# EAGLE schematic main-unit-psu (EAGLE 9.6.2)
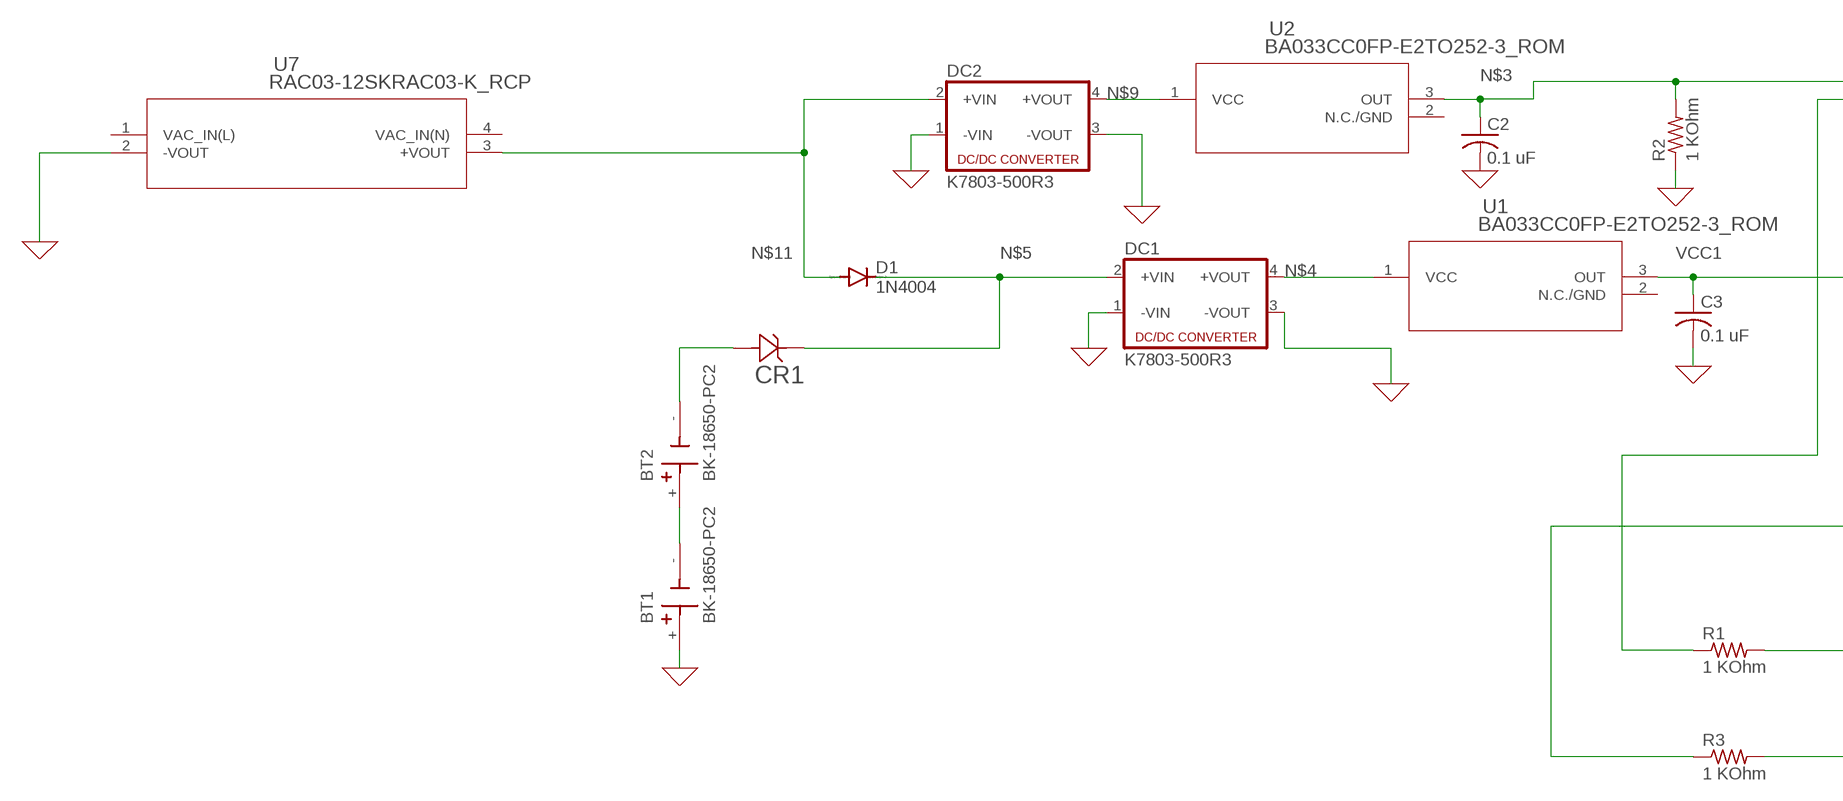
[diagram p0: schematic, sheet 1, part 1 of 2]
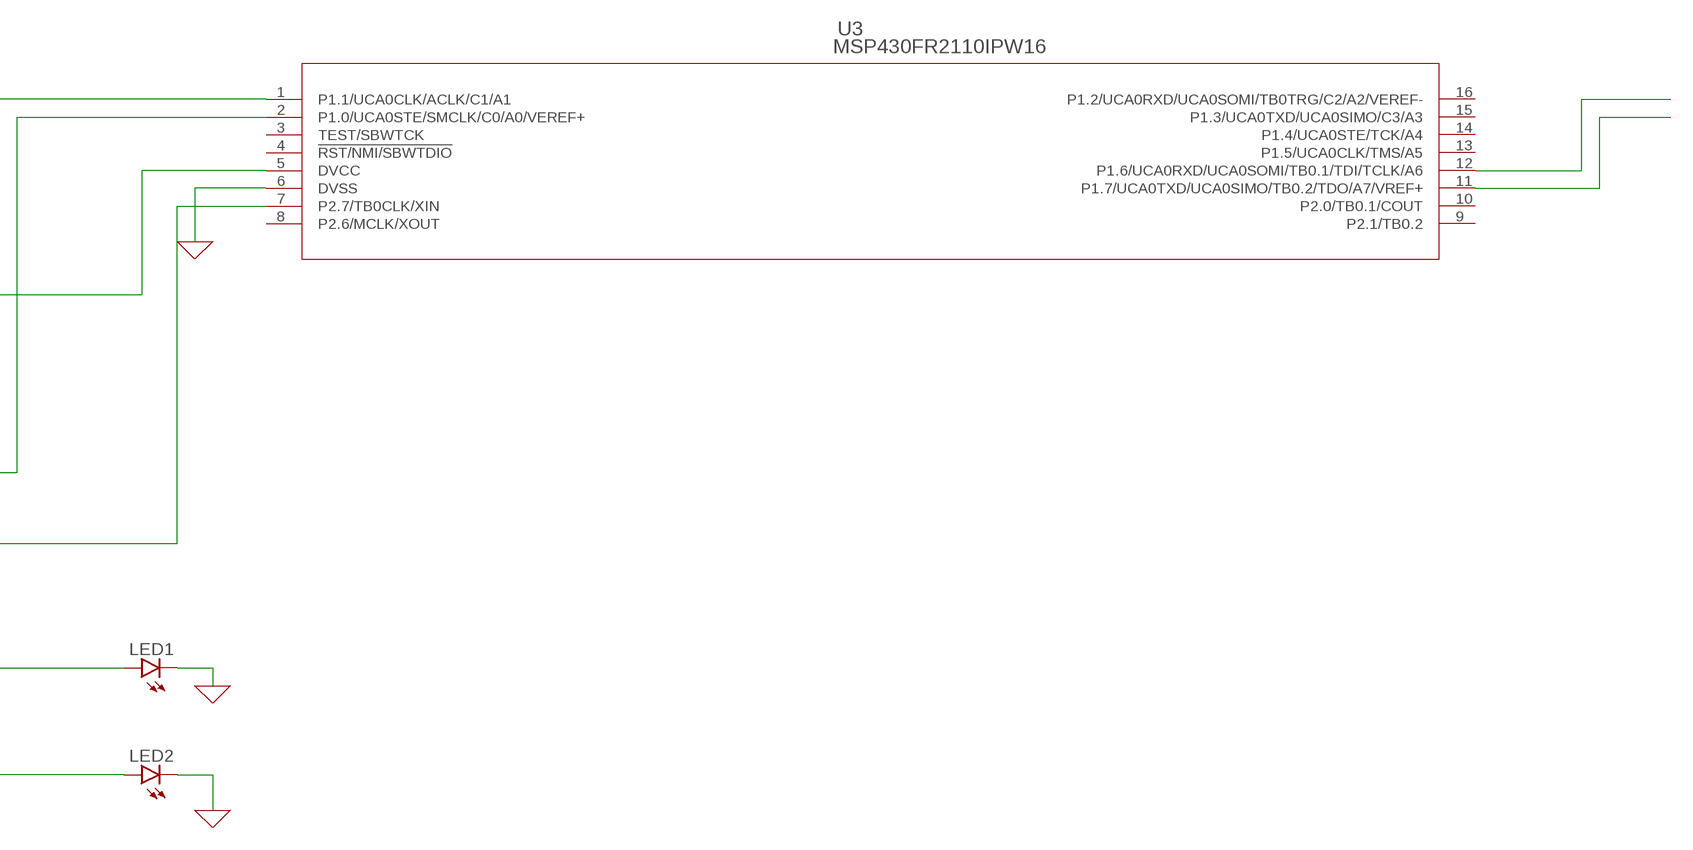
[diagram p1: schematic, sheet 1, part 2 of 2]

## Parts
BT1  BK-18650-PC2  [BAT_BK-18650-PC2]
BT2  BK-18650-PC2  [BAT_BK-18650-PC2]
C2  0.1 uF  C-US050-024X044  [C050-024X044]
C3  0.1 uF  C-US050-024X044  [C050-024X044]
CR1  1N5819DO-41_STM  [DO-41_STM]
D1  1N4004  [DO41-10]
DC1  K7803-500R3  NME  [NME]
DC2  K7803-500R3  NME  [NME]
LED1  LED5MM  [LED5MM]
LED2  LED5MM  [LED5MM]
R1  1 KOhm  R-US_0204/7  [0204/7]
R2  1 KOhm  R-US_0207/2V  [0207/2V]
R3  1 KOhm  R-US_0204/7  [0204/7]
U1  BA033CC0FP-E2TO252-3_ROM  [TO252-3_ROM]
U2  BA033CC0FP-E2TO252-3_ROM  [TO252-3_ROM]
U3  MSP430FR2110IPW16  [PW16_TEX]
U7  RAC03-12SKRAC03-K_RCP  [RAC03-K_RCP]

## Nets
0: BT1.+ C2.2 C3.2 DC1.1(-VIN) DC1.3(-VOUT) DC2.1(-VIN) DC2.3(-VOUT) LED1.K(C) LED2.K(C) R2.1 U3.6(DVSS) U7.2(-VOUT) ; supply symbol labelled GND
N$3: C2.1 R2.2 U2.3(OUT) U3.1(P1.1/UCA0CLK/ACLK/C1/A1)
N$4: DC1.4(+VOUT) U1.1(VCC)
N$5: CR1.1 D1.C DC1.2(+VIN)
N$6: BT1.- BT2.+
N$7: BT2.- CR1.2
N$9: DC2.4(+VOUT) U2.1(VCC)
N$10: U3.12(P1.6/UCA0RXD/UCA0SOMI/TB0.1/TDI/TCLK/A6)
N$11: D1.A DC2.2(+VIN) U7.3(+VOUT)
N$13: U3.11(P1.7/UCA0TXD/UCA0SIMO/TB0.2/TDO/A7/VREF+)
N$15: R3.1 U3.7(P2.7/TB0CLK/XIN)
N$16: LED1.A R1.2
N$17: LED2.A R3.2
N$22: R1.1 U3.2(P1.0/UCA0STE/SMCLK/C0/A0/VEREF+)
VCC1: C3.1 U1.3(OUT) U3.5(DVCC)
Unconnected: U1.2(N.C./GND) U2.2(N.C./GND) U3.3(TEST/SBWTCK) U3.4(!RST/NMI/SBWTDIO) U3.8(P2.6/MCLK/XOUT) U3.9(P2.1/TB0.2) U3.10(P2.0/TB0.1/COUT) U3.13(P1.5/UCA0CLK/TMS/A5) U3.14(P1.4/UCA0STE/TCK/A4) U3.15(P1.3/UCA0TXD/UCA0SIMO/C3/A3) U3.16(P1.2/UCA0RXD/UCA0SOMI/TB0TRG/C2/A2/VEREF-)

## Power pins joined to a net without a drawn wire
VAC_IN(L): U7.1(VAC_IN(L))
VAC_IN(N): U7.4(VAC_IN(N))

## Library data of the parts
BT1 BT2 = BK-18650-PC2:BK-18650-PC2: Battery Holder (Open) 18650 1 Cell PC Pin Check availability <https://pricing.snapeda.com/parts/BK-18650-PC2/MPD%20%28Memory%20Protection%20Devices%29/view-part?ref=eda>; AVAILABILITY: In Stock; DESCRIPTION: Battery Holder (Open) 18650 1 Cell PC Pin; MF: MPD (Memory Protection Devices); MP: BK-18650-PC2; PACKAGE: None; PRICE: None; PURCHASE-URL: https://pricing.snapeda.com/search/part/BK-18650-PC2/?ref=eda
C2 C3 = rcl:C-US: CAPACITOR, American symbol; SPICEPREFIX: C
CR1 = 2023-04-06_19-32-50_Library:1N5819; COPYRIGHT: Copyright (C) 2023 Ultra Librarian. All rights reserved.; DIGI-KEY_PART_NUMBER_1: 1N5819FSCT-ND; DIGI-KEY_PART_NUMBER_2: 1N5819FSTR-ND; DIGI-KEY_PART_NUMBER_3: 2156-1N5819-ND; DIGI-KEY_PART_NUMBER_4: 2368-1N5819-ND; DIGI-KEY_PART_NUMBER_5: 2796-1N5819TR-ND; DIGI-KEY_PART_NUMBER_6: 497-6610-1-ND; DIGI-KEY_PART_NUMBER_7: 497-6610-3-ND; MANUFACTURER_PART_NUMBER: 1N5819; MFR_NAME: STMicroelectronics
D1 = diode:1N4004: DIODE general purpose rectifier, 1 A
DC1 DC2 = dc-dc-converter:NME: DC-DC CONVERTER; MF: C & D TECHNOLOGIES, INC; MPN: NME1205D; OC_FARNELL: 1021466; OC_NEWARK: 98B8198
LED1 LED2 = led:LED: LED OSRAM: - CHIPLED LG R971, LG N971, LY N971, LG Q971, LY Q971, LO R971, LY R971 LH N974, LH R974 LS Q976, LO Q976, LY Q976 LO Q996 - Hyper CHIPLED LW Q18S LB Q993, LB Q99A, LB R99A - SideLED LS A670, LO A670, LY A670, LG A670, LP A670 LB A673, LV A673, LT A673, LW A673 LH A674 LY A675 LS A676, LA A676, LO A676, LY A676, LW A676 LS A679, LY A679, LG A679 - Hyper Micro SIDELED® LS Y876, LA Y876, LO Y876, LY Y876 LT Y87S - SmartLED LW L88C, LW L88S LB L89C, LB L89S, LG L890 LS L89K, LO L89K, LY L89K LS L896, LA L896, LO L896, LY L896 - TOPLED LS T670, LO T670, LY T670, LG T670, LP T670 LSG T670, LSP T670, LSY T670, LOP T670, LYG T670 LG T671, LOG T671, LSG T671 LB T673, LV T673, LT T673, LW T673 LH T674 LS T676, LA T676, LO T676, LY T676, LB T676, LH T676, LSB T676, LW T676 LB T67C, LV T67C, LT T67C, LS T67K, LO T67K, LY T67K, LW E67C LS E67B, LA E67B, LO E67B, LY E67B, LB E67C, LV E67C, LT E67C LW T67C LS T679, LY T679, LG T679 LS T770, LO T770, LY T770, LG T770, LP T770 LB T773, LV T773, LT T773, LW T773 LH T774 LS E675, LA E675, LY E675, LS T675 LS T776, LA T776, LO T776, LY T776, LB T776 LHGB T686 LT T68C, LB T68C - Hyper Mini TOPLED® LB M676 - Mini TOPLED Santana® LG M470 LS M47K, LO M47K, LY M47K Source: http://www.osram.convergy.de LUXEON: - LUMILED® LXK2-PW12-R00, LXK2-PW12-S00, LXK2-PW14-U00, LXK2-PW14-V00 LXK2-PM12-R00, LXK2-PM12-S00, LXK2-PM14-U00 LXK2-PE12-Q00, LXK2-PE12-R00, LXK2-PE12-S00, LXK2-PE14-T00, LXK2-PE14-U00 LXK2-PB12-K00, LXK2-PB12-L00, LXK2-PB12-M00, LXK2-PB14-N00, LXK2-PB14-P00, LXK2-PB14-Q00 LXK2-PR12-L00, LXK2-PR12-M00, LXK2-PR14-Q00, LXK2-PR14-R00 LXK2-PD12-Q00, LXK2-PD12-R00, LXK2-PD12-S00 LXK2-PH12-R00, LXK2-PH12-S00 LXK2-PL12-P00, LXK2-PL12-Q00, LXK2-PL12-R00 Source: www.luxeon.com KINGBRIGHT: KA-3528ASYC Source: www.kingbright.com
R1-R3 = rcl:R-US_: RESISTOR, American symbol; SPICEPREFIX: R
U1 U2 = 2023-03-08_12-17-23_Library:BA033CC0FP-E2; COPYRIGHT: Copyright (C) 2023 Ultra Librarian. All rights reserved.; DIGI-KEY_PART_NUMBER_1: BA033CC0FP-E2TR-ND; DIGI-KEY_PART_NUMBER_2: BA033CC0FP-E2CT-ND; DIGI-KEY_PART_NUMBER_3: BA033CC0FP-E2DKR-ND; MANUFACTURER_PART_NUMBER: BA033CC0FP-E2; MFR_NAME: ROHM Semiconductor
U3 = MSP430FR2110:MSP430FR2110IPW16; COPYRIGHT: Copyright (C) 2023 Ultra Librarian. All rights reserved.; MANUFACTURER_PART_NUMBER: MSP430FR2110IPW16; MFR_NAME: Texas Instruments
U7 = 2023-04-05_11-47-46_Library:RAC03-12SK; COPYRIGHT: Copyright (C) 2023 Ultra Librarian. All rights reserved.; DIGI-KEY_PART_NUMBER_1: 945-3442-ND; MANUFACTURER_PART_NUMBER: RAC03-12SK; MFR_NAME: Recom Power